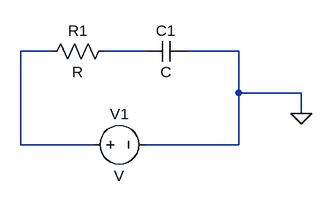
[diagram p0: schematic RC.asc]
RC.asc, the LTspice schematic file:
Version 4
SHEET 1 880 680
WIRE 96 176 48 176
WIRE 240 176 176 176
WIRE 384 176 304 176
WIRE 384 240 384 176
WIRE 480 240 384 240
WIRE 480 272 480 240
WIRE 48 320 48 176
WIRE 160 320 48 320
WIRE 384 320 384 240
WIRE 384 320 240 320
FLAG 480 272 0
SYMBOL res 192 160 R90
WINDOW 0 0 56 VBottom 2
WINDOW 3 32 56 VTop 2
SYMATTR InstName R1
SYMBOL cap 304 160 R90
WINDOW 0 0 32 VBottom 2
WINDOW 3 32 32 VTop 2
SYMATTR InstName C1
SYMBOL voltage 144 320 R270
WINDOW 0 32 56 VTop 2
WINDOW 3 -32 56 VBottom 2
SYMATTR InstName V1

The netlist it stands for:
* RC.asc
R1 N002 N001 R
C1 0 N002 C
V1 N001 0 V
.backanno
.end